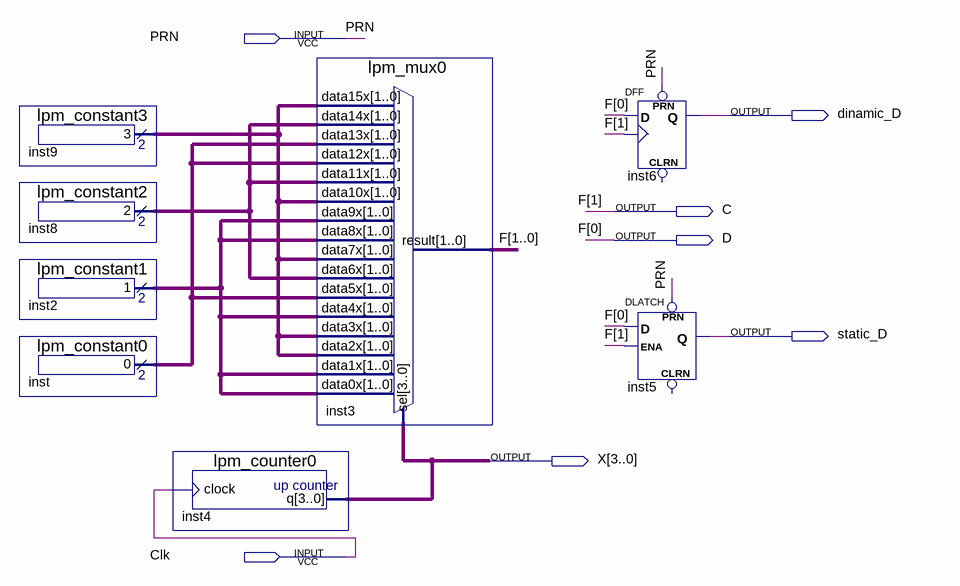
[diagram p0: schematic sheet]
// Quartus schematic lab04.bdf as structural Verilog: 8 symbols, 7 pins
module lab04 (
  input  PRN,
  input  Clk,
  output dinamic_D,
  output C,
  output D,
  output static_D,
  output [3:0] X
);

  wire [1:0] inst2_result, inst8_result, inst9_result, inst_result;

  lpm_constant3 inst9 (.result(inst9_result));
  lpm_constant2 inst8 (.result(inst8_result));
  lpm_constant1 inst2 (.result(inst2_result));
  lpm_constant0 inst (.result(inst_result));
  lpm_counter0 inst4 (.clock(Clk), .q(X));
  lpm_mux0 inst3 (
    .data15x(inst9_result), .data14x(inst8_result), .data13x(inst_result), .data12x(inst_result),
    .data11x(inst8_result), .data10x(inst9_result), .data9x(inst2_result), .data8x(inst2_result),
    .data7x(inst9_result), .data6x(inst8_result), .data5x(inst_result), .data4x(inst2_result),
    .data3x(inst9_result), .data2x(inst9_result), .data1x(inst2_result), .data0x(inst2_result), .sel(X),
    .result({C, D}));
  DFF inst6 (.CLK(C), .D(D), .PRN(PRN), .Q(dinamic_D));  // open: CLRN
  DLATCH inst5 (.D(D), .ENA(C), .PRN(PRN), .Q(static_D));  // open: CLRN

  // Other names for the same wires on the sheet: F[1:0] = {C, D}
endmodule
